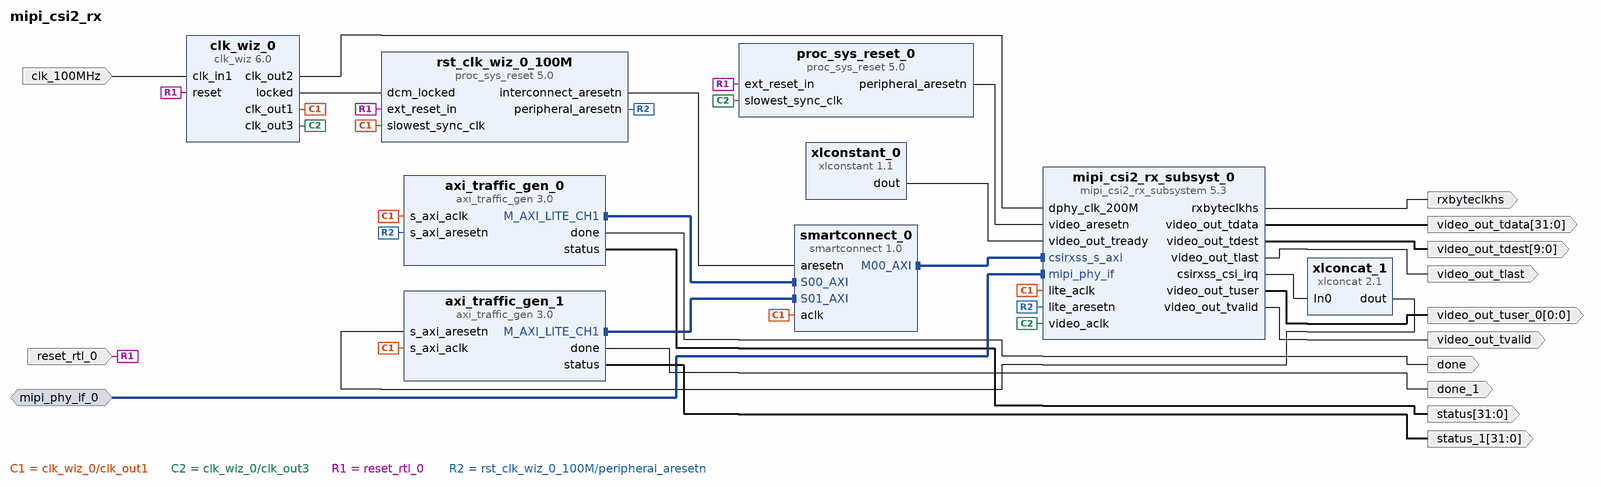
[diagram p0: block diagram of the top level]
# Vivado block design mipi_csi2_rx, xc7a35tfgg484-1, Vivado 2023.1
create_bd_design mipi_csi2_rx

create_bd_intf_port -mode Slave -vlnv xilinx.com:interface:mipi_phy_rtl:1.0 mipi_phy_if_0
create_bd_port -dir I -type clk clk_100MHz
set_property -dict {CONFIG.FREQ_HZ 100000000} [get_bd_ports clk_100MHz]
create_bd_port -dir O done
create_bd_port -dir O done_1
create_bd_port -dir I -type rst reset_rtl_0
set_property -dict {CONFIG.POLARITY ACTIVE_HIGH} [get_bd_ports reset_rtl_0]
create_bd_port -dir O -type clk rxbyteclkhs
create_bd_port -dir O -from 31 -to 0 status
create_bd_port -dir O -from 31 -to 0 status_1
create_bd_port -dir O -from 31 -to 0 video_out_tdata
create_bd_port -dir O -from 9 -to 0 video_out_tdest
create_bd_port -dir O video_out_tlast
create_bd_port -dir O video_out_tvalid
create_bd_port -dir O -from 0 -to 0 video_out_tuser_0

create_bd_cell -type ip -vlnv xilinx.com:ip:axi_traffic_gen:3.0 axi_traffic_gen_0
set_property -dict [list \
  CONFIG.ATG_OPTIONS Custom \
  CONFIG.C_ATG_MIF_DATA_DEPTH 256 \
  CONFIG.C_ATG_MODE AXI4-Lite \
  CONFIG.C_ATG_SYSINIT_MODES System_Test \
  CONFIG.C_ATG_SYSTEM_CH1_HIGH 0x44a2FFFF \
  CONFIG.C_ATG_SYSTEM_CH1_LOW 0x44A00000 \
  CONFIG.C_ATG_SYSTEM_CH2_HIGH 0x44A1FFFF \
  CONFIG.C_ATG_SYSTEM_CH2_LOW 0x44A10000 \
  CONFIG.C_ATG_SYSTEM_CH3_HIGH 0x44A0FFFF \
  CONFIG.C_ATG_SYSTEM_CH3_LOW 0x44A00000 \
  CONFIG.C_ATG_SYSTEM_CMD_MAX_RETRY 4294967280 \
  CONFIG.C_ATG_SYSTEM_INIT_ADDR_MIF ../../../coe/addr_rxsim.coe \
  CONFIG.C_ATG_SYSTEM_INIT_CTRL_MIF ../../../coe/ctrl_rxsim.coe \
  CONFIG.C_ATG_SYSTEM_INIT_DATA_MIF ../../../coe/data_rxsim.coe \
  CONFIG.C_ATG_SYSTEM_INIT_MASK_MIF ../../../coe/mask_rxsim.coe \
  CONFIG.C_ATG_SYSTEM_MAX_CHANNELS 1 \
  CONFIG.C_ATG_SYSTEM_TEST_MAX_CLKS 4294967290 \
] [get_bd_cells axi_traffic_gen_0]
create_bd_cell -type ip -vlnv xilinx.com:ip:axi_traffic_gen:3.0 axi_traffic_gen_1
set_property -dict [list \
  CONFIG.ATG_OPTIONS Custom \
  CONFIG.C_ATG_MIF_DATA_DEPTH 16 \
  CONFIG.C_ATG_MODE AXI4-Lite \
  CONFIG.C_ATG_SYSINIT_MODES System_Test \
  CONFIG.C_ATG_SYSTEM_CH1_HIGH 0x44a2FFFF \
  CONFIG.C_ATG_SYSTEM_CH1_LOW 0x44A20000 \
  CONFIG.C_ATG_SYSTEM_CH2_HIGH 0x44A1FFFF \
  CONFIG.C_ATG_SYSTEM_CH2_LOW 0x44A10000 \
  CONFIG.C_ATG_SYSTEM_CH3_HIGH 0x44A0FFFF \
  CONFIG.C_ATG_SYSTEM_CH3_LOW 0x44A00000 \
  CONFIG.C_ATG_SYSTEM_CMD_MAX_RETRY 4294967280 \
  CONFIG.C_ATG_SYSTEM_INIT_ADDR_MIF ../../../coe/addr2.coe \
  CONFIG.C_ATG_SYSTEM_INIT_CTRL_MIF ../../../coe/ctrl2.coe \
  CONFIG.C_ATG_SYSTEM_INIT_DATA_MIF ../../../coe/data2.coe \
  CONFIG.C_ATG_SYSTEM_INIT_MASK_MIF ../../../coe/mask2.coe \
  CONFIG.C_ATG_SYSTEM_MAX_CHANNELS 1 \
  CONFIG.C_ATG_SYSTEM_TEST_MAX_CLKS 4294967290 \
] [get_bd_cells axi_traffic_gen_1]
create_bd_cell -type ip -vlnv xilinx.com:ip:clk_wiz:6.0 clk_wiz_0
set_property -dict [list \
  CONFIG.CLKOUT1_JITTER 130.958 \
  CONFIG.CLKOUT1_PHASE_ERROR 98.575 \
  CONFIG.CLKOUT1_REQUESTED_OUT_FREQ 100.000 \
  CONFIG.CLKOUT2_JITTER 114.829 \
  CONFIG.CLKOUT2_PHASE_ERROR 98.575 \
  CONFIG.CLKOUT2_REQUESTED_OUT_FREQ 200.000 \
  CONFIG.CLKOUT2_USED true \
  CONFIG.CLKOUT3_JITTER 130.958 \
  CONFIG.CLKOUT3_PHASE_ERROR 98.575 \
  CONFIG.CLKOUT3_REQUESTED_OUT_FREQ 100.000 \
  CONFIG.CLKOUT3_USED true \
  CONFIG.CLKOUT4_JITTER 94.862 \
  CONFIG.CLKOUT4_PHASE_ERROR 87.180 \
  CONFIG.CLKOUT4_REQUESTED_OUT_FREQ 100.000 \
  CONFIG.CLKOUT4_USED false \
  CONFIG.MMCM_CLKFBOUT_MULT_F 10.000 \
  CONFIG.MMCM_CLKIN1_PERIOD 10.000 \
  CONFIG.MMCM_CLKIN2_PERIOD 10.000 \
  CONFIG.MMCM_CLKOUT0_DIVIDE_F 10.000 \
  CONFIG.MMCM_CLKOUT1_DIVIDE 5 \
  CONFIG.MMCM_CLKOUT2_DIVIDE 10 \
  CONFIG.MMCM_CLKOUT3_DIVIDE 1 \
  CONFIG.MMCM_DIVCLK_DIVIDE 1 \
  CONFIG.NUM_OUT_CLKS 3 \
  CONFIG.USE_FREQ_SYNTH true \
] [get_bd_cells clk_wiz_0]
create_bd_cell -type ip -vlnv xilinx.com:ip:mipi_csi2_rx_subsystem:5.3 mipi_csi2_rx_subsyst_0
set_property -dict [list \
  CONFIG.CMN_INC_IIC false \
  CONFIG.CMN_NUM_LANES 4 \
  CONFIG.CMN_NUM_PIXELS 2 \
  CONFIG.CMN_PXL_FORMAT RGB565 \
  CONFIG.CMN_VC All \
  CONFIG.CSI_BUF_DEPTH 8192 \
  CONFIG.C_CSI_EN_CRC false \
  CONFIG.C_HS_LINE_RATE 800 \
  CONFIG.C_HS_SETTLE_NS 160 \
  CONFIG.DPY_EN_REG_IF true \
  CONFIG.DPY_LINE_RATE 400 \
  CONFIG.VFB_TU_WIDTH 1 \
] [get_bd_cells mipi_csi2_rx_subsyst_0]
create_bd_cell -type ip -vlnv xilinx.com:ip:proc_sys_reset:5.0 proc_sys_reset_0
set_property -dict {CONFIG.C_NUM_PERP_ARESETN 1} [get_bd_cells proc_sys_reset_0]
create_bd_cell -type ip -vlnv xilinx.com:ip:proc_sys_reset:5.0 rst_clk_wiz_0_100M
set_property -dict {CONFIG.C_NUM_PERP_ARESETN 1} [get_bd_cells rst_clk_wiz_0_100M]
create_bd_cell -type ip -vlnv xilinx.com:ip:smartconnect:1.0 smartconnect_0
set_property -dict {CONFIG.HAS_ARESETN 1 CONFIG.NUM_MI 1} [get_bd_cells smartconnect_0]
create_bd_cell -type ip -vlnv xilinx.com:ip:xlconcat:2.1 xlconcat_1
set_property -dict [list \
  CONFIG.IN1_WIDTH 32 \
  CONFIG.IN2_WIDTH 15 \
  CONFIG.IN3_WIDTH 16 \
  CONFIG.IN4_WIDTH 32 \
  CONFIG.NUM_PORTS 1 \
] [get_bd_cells xlconcat_1]
create_bd_cell -type ip -vlnv xilinx.com:ip:xlconstant:1.1 xlconstant_0
set_property -dict {CONFIG.CONST_VAL 1} [get_bd_cells xlconstant_0]

# ---- connections ----

connect_bd_intf_net [get_bd_intf_pins axi_traffic_gen_0/M_AXI_LITE_CH1] [get_bd_intf_pins smartconnect_0/S00_AXI]
connect_bd_intf_net [get_bd_intf_pins axi_traffic_gen_1/M_AXI_LITE_CH1] [get_bd_intf_pins smartconnect_0/S01_AXI]
connect_bd_intf_net -intf_net mipi_phy_if_0_1 [get_bd_intf_ports mipi_phy_if_0] [get_bd_intf_pins mipi_csi2_rx_subsyst_0/mipi_phy_if]
connect_bd_intf_net [get_bd_intf_pins smartconnect_0/M00_AXI] [get_bd_intf_pins mipi_csi2_rx_subsyst_0/csirxss_s_axi]
connect_bd_net [get_bd_pins clk_wiz_0/clk_out2] [get_bd_pins mipi_csi2_rx_subsyst_0/dphy_clk_200M]
connect_bd_net [get_bd_pins axi_traffic_gen_0/done] [get_bd_ports done]
connect_bd_net [get_bd_pins axi_traffic_gen_0/status] [get_bd_ports status]
connect_bd_net [get_bd_pins axi_traffic_gen_1/done] [get_bd_ports done_1]
connect_bd_net [get_bd_pins axi_traffic_gen_1/status] [get_bd_ports status_1]
connect_bd_net [get_bd_ports clk_100MHz] [get_bd_pins clk_wiz_0/clk_in1]
connect_bd_net [get_bd_pins clk_wiz_0/clk_out1] \
  [get_bd_pins axi_traffic_gen_0/s_axi_aclk] [get_bd_pins axi_traffic_gen_1/s_axi_aclk] \
  [get_bd_pins mipi_csi2_rx_subsyst_0/lite_aclk] [get_bd_pins rst_clk_wiz_0_100M/slowest_sync_clk] \
  [get_bd_pins smartconnect_0/aclk]
connect_bd_net [get_bd_pins clk_wiz_0/clk_out3] [get_bd_pins mipi_csi2_rx_subsyst_0/video_aclk] [get_bd_pins proc_sys_reset_0/slowest_sync_clk]
connect_bd_net [get_bd_pins clk_wiz_0/locked] [get_bd_pins rst_clk_wiz_0_100M/dcm_locked]
connect_bd_net [get_bd_pins mipi_csi2_rx_subsyst_0/csirxss_csi_irq] [get_bd_pins xlconcat_1/In0]
connect_bd_net [get_bd_pins mipi_csi2_rx_subsyst_0/rxbyteclkhs] [get_bd_ports rxbyteclkhs]
connect_bd_net [get_bd_pins mipi_csi2_rx_subsyst_0/video_out_tdata] [get_bd_ports video_out_tdata]
connect_bd_net [get_bd_pins mipi_csi2_rx_subsyst_0/video_out_tdest] [get_bd_ports video_out_tdest]
connect_bd_net [get_bd_pins mipi_csi2_rx_subsyst_0/video_out_tlast] [get_bd_ports video_out_tlast]
connect_bd_net [get_bd_pins mipi_csi2_rx_subsyst_0/video_out_tuser] [get_bd_ports video_out_tuser_0]
connect_bd_net [get_bd_pins mipi_csi2_rx_subsyst_0/video_out_tvalid] [get_bd_ports video_out_tvalid]
connect_bd_net [get_bd_pins proc_sys_reset_0/peripheral_aresetn] [get_bd_pins mipi_csi2_rx_subsyst_0/video_aresetn]
connect_bd_net -net reset_rtl_0_1 [get_bd_ports reset_rtl_0] \
  [get_bd_pins clk_wiz_0/reset] [get_bd_pins proc_sys_reset_0/ext_reset_in] [get_bd_pins rst_clk_wiz_0_100M/ext_reset_in]
connect_bd_net -net rst_clk_wiz_0_100M1_peripheral_aresetn [get_bd_pins xlconcat_1/dout] [get_bd_pins axi_traffic_gen_1/s_axi_aresetn]
connect_bd_net [get_bd_pins rst_clk_wiz_0_100M/interconnect_aresetn] [get_bd_pins smartconnect_0/aresetn]
connect_bd_net [get_bd_pins rst_clk_wiz_0_100M/peripheral_aresetn] \
  [get_bd_pins axi_traffic_gen_0/s_axi_aresetn] [get_bd_pins mipi_csi2_rx_subsyst_0/lite_aresetn]
connect_bd_net [get_bd_pins xlconstant_0/dout] [get_bd_pins mipi_csi2_rx_subsyst_0/video_out_tready]

# ---- address map ----
assign_bd_address -offset 0x44A20000 -range 64K -target_address_space [get_bd_addr_spaces axi_traffic_gen_0/Reg1] [get_bd_addr_segs mipi_csi2_rx_subsyst_0/csirxss_s_axi/Reg]
assign_bd_address -offset 0x44A20000 -range 64K -target_address_space [get_bd_addr_spaces axi_traffic_gen_1/Reg1] [get_bd_addr_segs mipi_csi2_rx_subsyst_0/csirxss_s_axi/Reg]

validate_bd_design
save_bd_design
